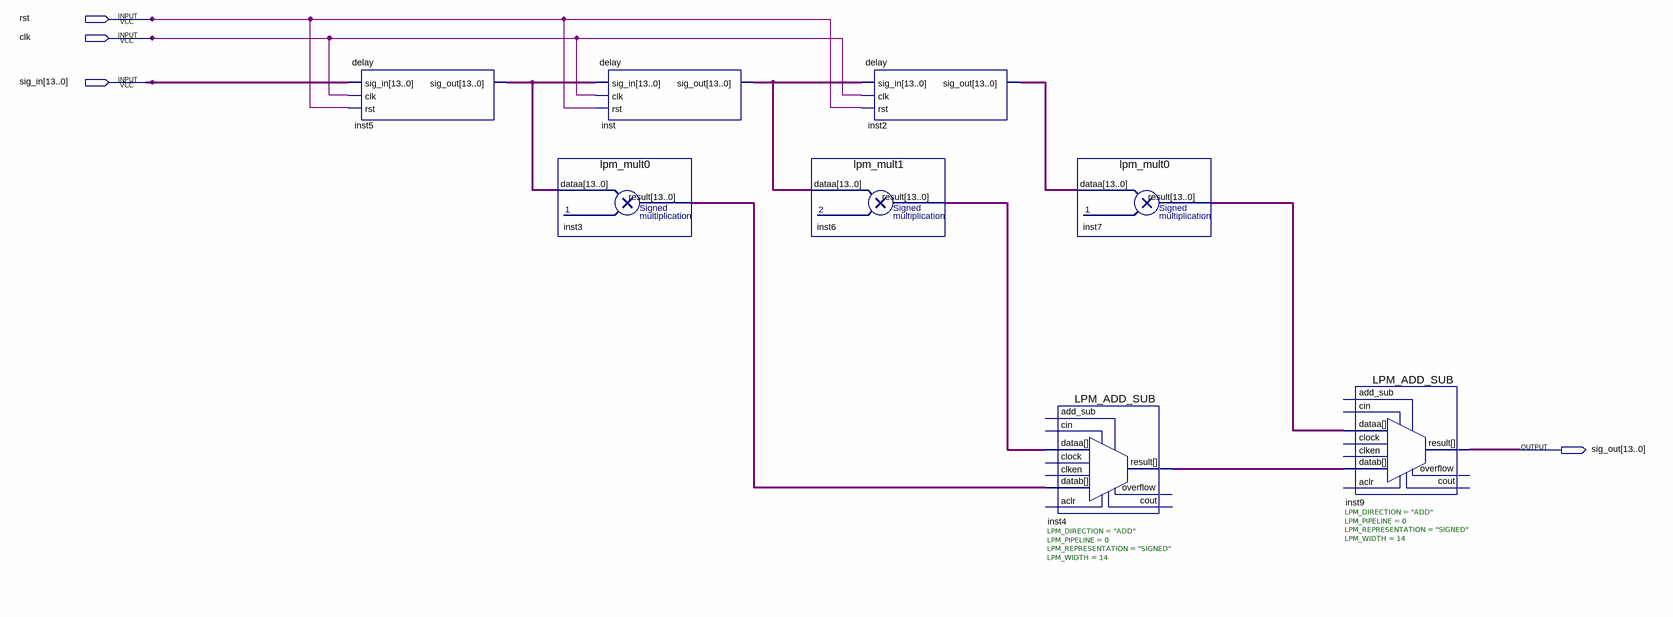
[diagram p0: schematic sheet]
// Quartus schematic low_pass_direct_graph.bdf as structural Verilog: 8 symbols, 4 pins
module low_pass_direct_graph (
  input  rst,
  input  clk,
  input  [13:0] sig_in,
  output [13:0] sig_out
);

  wire [13:0] inst2_sig_out, inst3_result, inst4_result, inst5_sig_out, inst6_result, inst7_result,
       inst_sig_out;

  delay inst5 (.sig_in(sig_in), .clk(clk), .rst(rst), .sig_out(inst5_sig_out));
  lpm_mult0 inst3 (.dataa(inst5_sig_out), .result(inst3_result));
  delay inst (.sig_in(inst5_sig_out), .clk(clk), .rst(rst), .sig_out(inst_sig_out));
  lpm_mult1 inst6 (.dataa(inst_sig_out), .result(inst6_result));
  delay inst2 (.sig_in(inst_sig_out), .clk(clk), .rst(rst), .sig_out(inst2_sig_out));
  LPM_ADD_SUB #(.LPM_DIRECTION("ADD"), .LPM_PIPELINE(0), .LPM_REPRESENTATION("SIGNED"), .LPM_WIDTH(14)) inst4 (
    .datab(inst3_result), .dataa(inst6_result), .result(inst4_result));  // open: add_sub, cin, aclr, clock, clken, cout, overflow
  lpm_mult0 inst7 (.dataa(inst2_sig_out), .result(inst7_result));
  LPM_ADD_SUB #(.LPM_DIRECTION("ADD"), .LPM_PIPELINE(0), .LPM_REPRESENTATION("SIGNED"), .LPM_WIDTH(14)) inst9 (
    .datab(inst4_result), .dataa(inst7_result), .result(sig_out));  // open: add_sub, cin, aclr, clock, clken, cout, overflow
endmodule
